# EAGLE design Nano+Sensores (EAGLE 8.5.1)
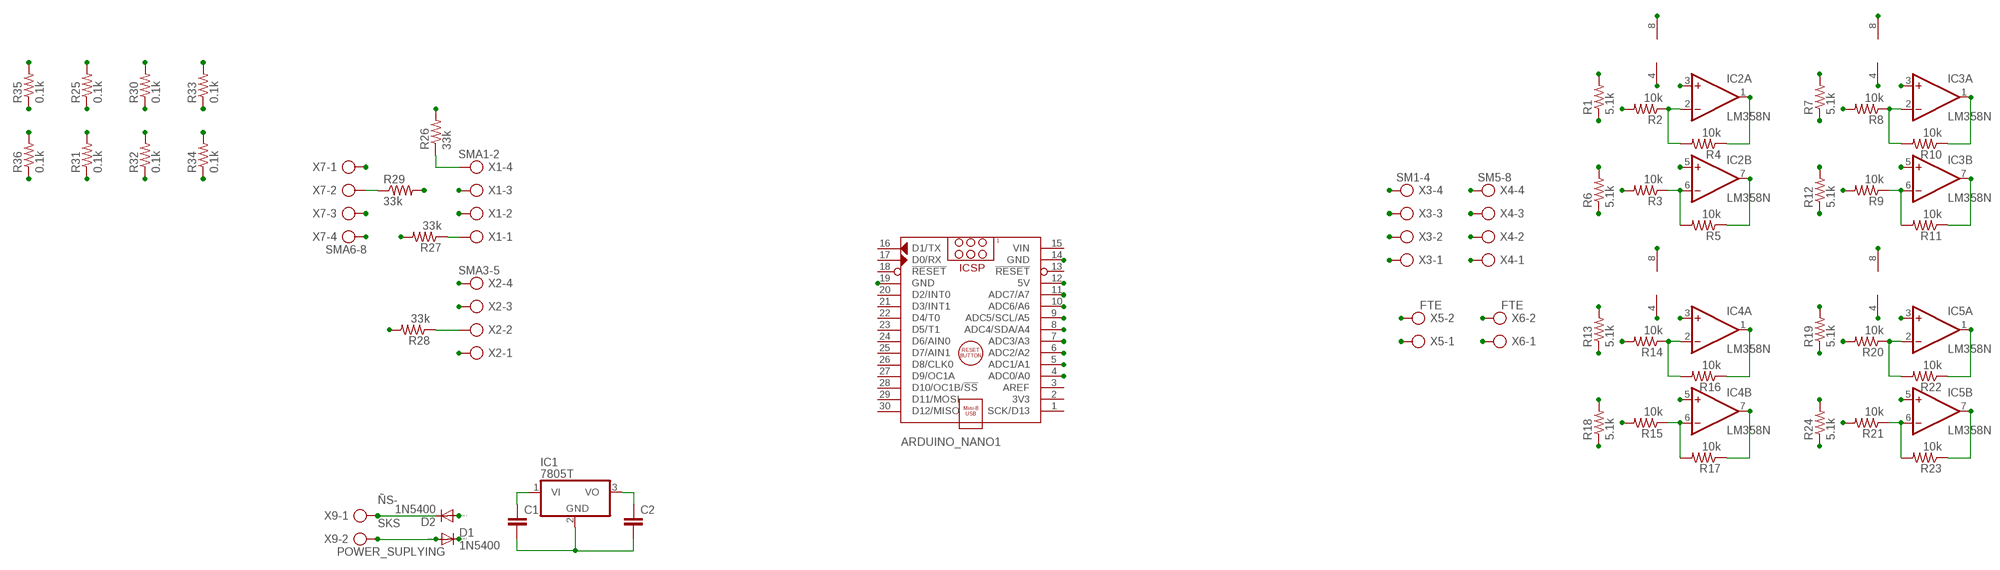
[diagram p0: schematic, sheet 1]

## Parts
ARDUINO_NANO1  ARDUINO_NANO  [ARDUINO_NANO]
C1  C-EU025-025X050  [C025-025X050]
C2  C-EU025-025X050  [C025-025X050]
D1  1N5400  [DO201-15]
D2  1N5400  [DO201-15]
IC1  7805T  [TO220H]
IC2  LM358N  [DIL08]
IC3  LM358N  [DIL08]
IC4  LM358N  [DIL08]
IC5  LM358N  [DIL08]
R1  5.1k  R-US_0204/5  [0204/5]
R2  10k  R-US_0204/5  [0204/5]
R3  10k  R-US_0204/5  [0204/5]
R4  10k  R-US_0204/5  [0204/5]
R5  10k  R-US_0204/5  [0204/5]
R6  5.1k  R-US_0204/5  [0204/5]
R7  5.1k  R-US_0204/5  [0204/5]
R8  10k  R-US_0204/5  [0204/5]
R9  10k  R-US_0204/5  [0204/5]
R10  10k  R-US_0204/5  [0204/5]
R11  10k  R-US_0204/5  [0204/5]
R12  5.1k  R-US_0204/5  [0204/5]
R13  5.1k  R-US_0204/5  [0204/5]
R14  10k  R-US_0204/5  [0204/5]
R15  10k  R-US_0204/5  [0204/5]
R16  10k  R-US_0204/5  [0204/5]
R17  10k  R-US_0204/5  [0204/5]
R18  5.1k  R-US_0204/5  [0204/5]
R19  5.1k  R-US_0204/5  [0204/5]
R20  10k  R-US_0204/5  [0204/5]
R21  10k  R-US_0204/5  [0204/5]
R22  10k  R-US_0204/5  [0204/5]
R23  10k  R-US_0204/5  [0204/5]
R24  5.1k  R-US_0204/5  [0204/5]
R25  0.1k  R-US_0204/5  [0204/5]
R26  33k  R-US_0204/5  [0204/5]
R27  33k  R-US_0204/5  [0204/5]
R28  33k  R-US_0204/5  [0204/5]
R29  33k  R-US_0204/5  [0204/5]
R30  0.1k  R-US_0204/5  [0204/5]
R31  0.1k  R-US_0204/5  [0204/5]
R32  0.1k  R-US_0204/5  [0204/5]
R33  0.1k  R-US_0204/5  [0204/5]
R34  0.1k  R-US_0204/5  [0204/5]
R35  0.1k  R-US_0204/5  [0204/5]
R36  0.1k  R-US_0204/5  [0204/5]
X1  SMA1-2  AK300/4  [AK300/4]
X2  SMA3-5  AK300/4  [AK300/4]
X3  SM1-4  AK300/4  [AK300/4]
X4  SM5-8  AK300/4  [AK300/4]
X5  FTE  AK300/2  [AK300/2]
X6  FTE  AK300/2  [AK300/2]
X7  SMA6-8  AK300/4  [AK300/4]
X9  POWER_SUPLYING  AK300/2  [AK300/2]

## Nets
+5V: ARDUINO_NANO1.12(5V) C2.1 IC1.3(VO) IC2.8(P:V+) IC3.8(P:V+) IC4.8(P:V+) IC5.8(P:V+) R1.2 R6.2 R7.2 R12.2 R13.2 R18.2 R19.2 R24.2 R25.2 R30.2 R31.2 R32.2 R33.2 R34.2 R35.2 R36.2
+12V: C1.1 D1.C IC1.1(VI) X5.2 X6.2
A0: ARDUINO_NANO1.4(ADC0/A0) IC2.1(A:OUT) R4.1
A1: ARDUINO_NANO1.5(ADC1/A1) IC2.7(B:OUT) R5.1
A2: ARDUINO_NANO1.6(ADC2/A2) IC3.1(A:OUT) R10.1
A3: ARDUINO_NANO1.7(ADC3/A3) IC3.7(B:OUT) R11.1
A4: ARDUINO_NANO1.8(ADC4/SDA/A4) IC4.1(A:OUT) R16.1
A5: ARDUINO_NANO1.9(ADC5/SCL/A5) IC4.7(B:OUT) R17.1
A6: ARDUINO_NANO1.10(ADC6/A6) IC5.1(A:OUT) R22.1
A7: ARDUINO_NANO1.11(ADC7/A7) IC5.7(B:OUT) R23.1
GND: ARDUINO_NANO1.14(GND) ARDUINO_NANO1.19(GND) C1.2 C2.2 D2.A IC1.2(GND) IC2.3(A:+IN) IC2.4(P:V-) IC2.5(B:+IN) IC3.3(A:+IN) IC3.4(P:V-) IC3.5(B:+IN) IC4.3(A:+IN) IC4.4(P:V-) IC4.5(B:+IN) IC5.3(A:+IN) IC5.4(P:V-) IC5.5(B:+IN) R26.2 R27.2 R28.2 R29.2 X5.1 X6.1
N$1: IC2.2(A:-IN) R2.1 R4.2
N$2: R27.1 X1.1
N$3: R29.1 X7.2
N$4: IC2.6(B:-IN) R3.1 R5.2
N$5: IC3.2(A:-IN) R8.1 R10.2
N$6: R26.1 X1.4
N$7: R28.1 X2.2
N$8: IC3.6(B:-IN) R9.1 R11.2
N$9: IC4.2(A:-IN) R14.1 R16.2
N$12: IC4.6(B:-IN) R15.1 R17.2
N$13: IC5.2(A:-IN) R20.1 R22.2
N$16: IC5.6(B:-IN) R21.1 R23.2
SG_SM1: R1.1 R2.2 X3.4
SG_SM2: R3.2 R6.1 X3.3
SG_SM3: R7.1 R8.2 X3.2
SG_SM4: R9.2 R12.1 X3.1
SG_SM5: R13.1 R14.2 X4.4
SG_SM6: R15.2 R18.1 X4.3
SG_SM7: R19.1 R20.2 X4.2
SG_SM8: R21.2 R24.1 X4.1
SKS: D1.A X9.2
SMA1: R25.1 X1.3
SMA2: R30.1 X1.2
SMA3: R33.1 X2.4
SMA4: R31.1 X2.3
SMA5: R32.1 X2.1
SMA6: R34.1 X7.1
SMA7: R35.1 X7.3
SMA8: R36.1 X7.4
ÑS-: D2.C X9.1
Unconnected: ARDUINO_NANO1.1(SCK/D13) ARDUINO_NANO1.2(3V3) ARDUINO_NANO1.3(AREF) ARDUINO_NANO1.13(!RESET) ARDUINO_NANO1.16(D1/TX) ARDUINO_NANO1.17(D0/RX) ARDUINO_NANO1.18(!RESET) ARDUINO_NANO1.20(D2/INT0) ARDUINO_NANO1.21(D3/INT1) ARDUINO_NANO1.22(D4/T0) ARDUINO_NANO1.23(D5/T1) ARDUINO_NANO1.24(D6/AIN0) ARDUINO_NANO1.25(D7/AIN1) ARDUINO_NANO1.26(D8/CLK0) ARDUINO_NANO1.27(D9/OC1A) ARDUINO_NANO1.28(D10/OC1B/!SS) ARDUINO_NANO1.29(D11/MOSI) ARDUINO_NANO1.30(D12/MISO)

## Power pins joined to a net without a drawn wire
VIN: ARDUINO_NANO1.15(VIN)

## Library data of the parts
ARDUINO_NANO1 = ArduinoNanoV30:ARDUINO_NANO: Arduino Nano V3.0 Module Overview: The Arduino Nano is a small, complete, and breadboard-friendly board based on the ATmega328 (Arduino Nano 3.x) or ATmega168 (Arduino Nano 2.x). It has more or less the same functionality of the Arduino Duemilanove, but in a different package. It lacks only a DC power jack, and works with a Mini-B USB cable instead of a standard one. The Nano was designed and is being produced by Gravitech <http://www.gravitech.us/arna30wiatp.html>. General specifications: Item Value Microcontroller Atmel ATmega168 or ATmega328 Operating Voltage (logic level) 5 V Input Voltage (recommended) 7-12 V Input Voltage (limits) 6-20 V Digital I/O Pins 14 (of which 6 provide PWM output) Analog Input Pins 8 DC Current per I/O Pin 40 mA Flash Memory 16 KB (ATmega168) or 32 KB (ATmega328) of which 2 KB used by bootloader SRAM 1 KB (ATmega168) or 2 KB (ATmega328) EEPROM 512 bytes (ATmega168) or 1 KB (ATmega328) Clock Speed 16 MHz Dimensions (Inches) 0.73" x 1.70" Dimensions (mm) 18mm x 45mm Overall height About 9 mm (not including pins) Weigth 5 g Power: The Arduino Nano can be powered via the Mini-B USB connection, 6-20V unregulated external power supply (pin 30), or 5V regulated external power supply (pin 27). The power source is automatically selected to the highest voltage source. Memory: The ATmega168 has 16 KB of flash memory for storing code (of which 2 KB is used for the bootloader); the ATmega328 has 32 KB, (also with 2 KB used for the bootloader). The ATmega168 has 1 KB of SRAM and 512 bytes of EEPROM (which can be read and written with the EEPROM library); the ATmega328 has 2 KB of SRAM and 1 KB of EEPROM. Input and Output: Each of the 14 digital pins on the Nano can be used as an input or output, using pinMode(), digitalWrite(), and digitalRead() functions. They operate at 5 volts. Each pin can provide or receive a maximum of 40 mA and has an internal pull-up resistor (disconnected by default) of 20-50 kOhms. In addition, some pins have specialized functions. Visit Arduino - ArduinoBoardNano <https://www.arduino.cc/en/Main/ArduinoBoardNano>
C1 C2 = rcl:C-EU: CAPACITOR, European symbol; SPICEPREFIX: C
D1 D2 = diode:1N5400: DIODE standard rectifier, 3 A, 50 V (Motorola)
IC1 = linear:78*: Positive VOLTAGE REGULATOR Source: http://cache.national.com/ds/LM/LM78L05.pdf http://www.fairchildsemi.com/ds/LM/LM7805.pdf
IC2-IC5 = linear:LM358: OP AMP also LM158; LM258; LM2904 Source: http://cache.national.com/ds/LM/LM158.pdf
R1-R36 = rcl:R-US_: RESISTOR, American symbol; SPICEPREFIX: R
X1-X4 X7 = con-ptr500:AK300/4: CONNECTOR; OC_FARNELL: unknown; OC_NEWARK: unknown
X5 X6 X9 = con-ptr500:AK300/2: CONNECTOR; OC_FARNELL: unknown; OC_NEWARK: unknown

## Board
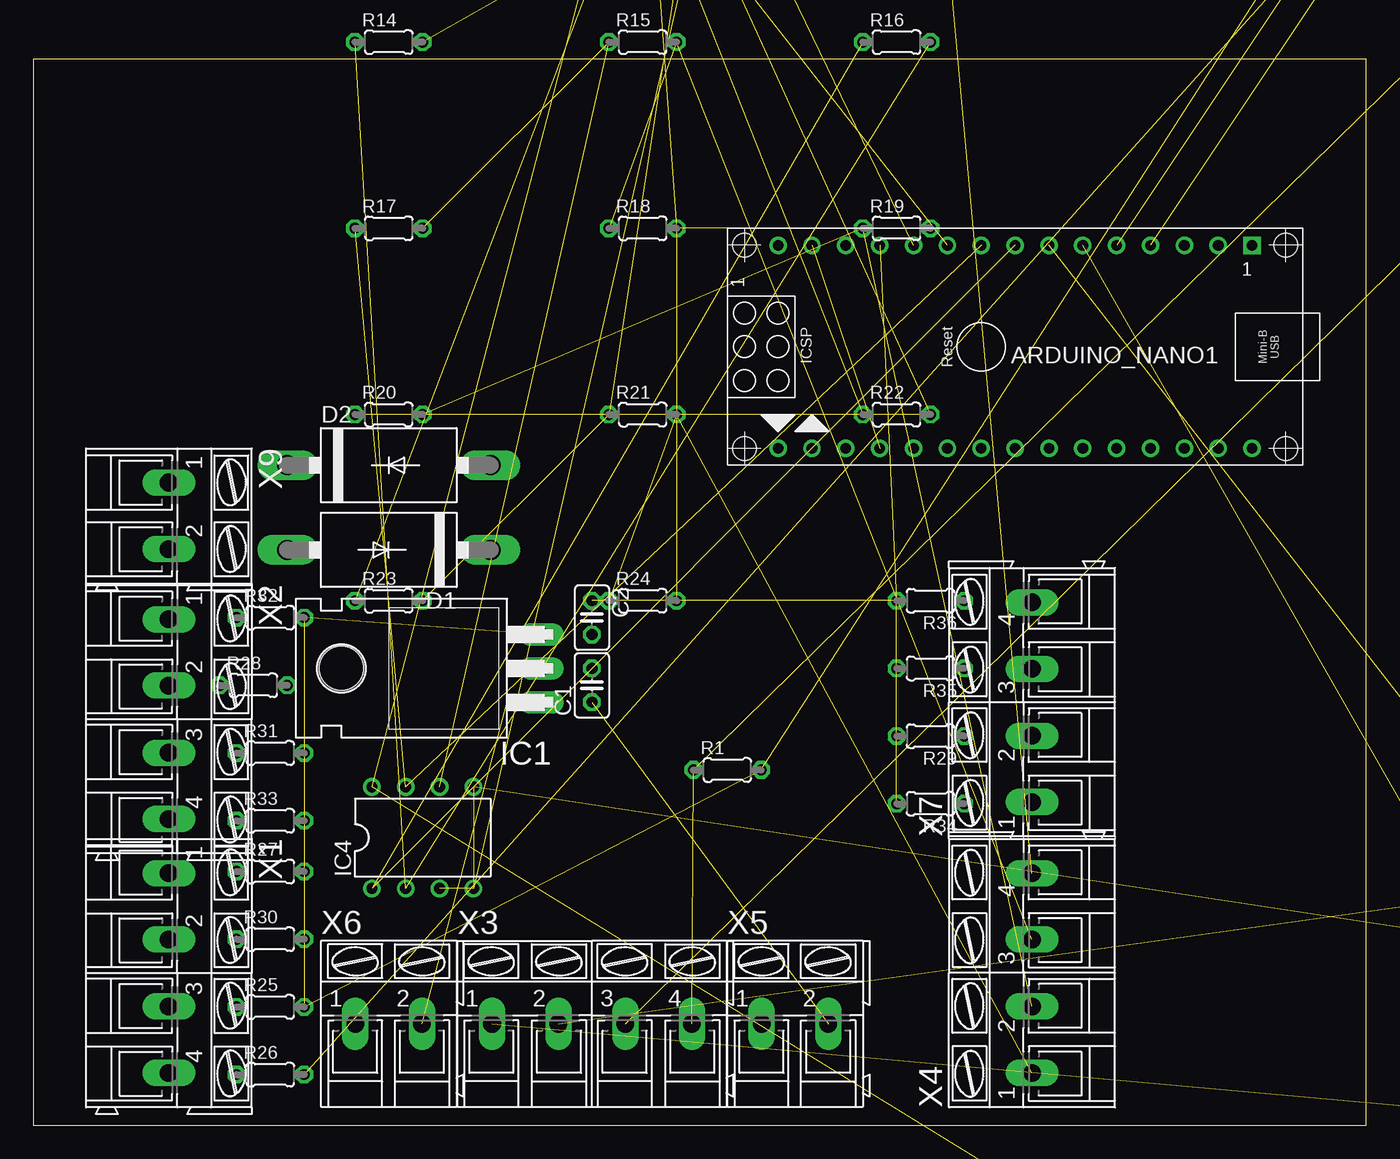
[diagram p1: board, top side]
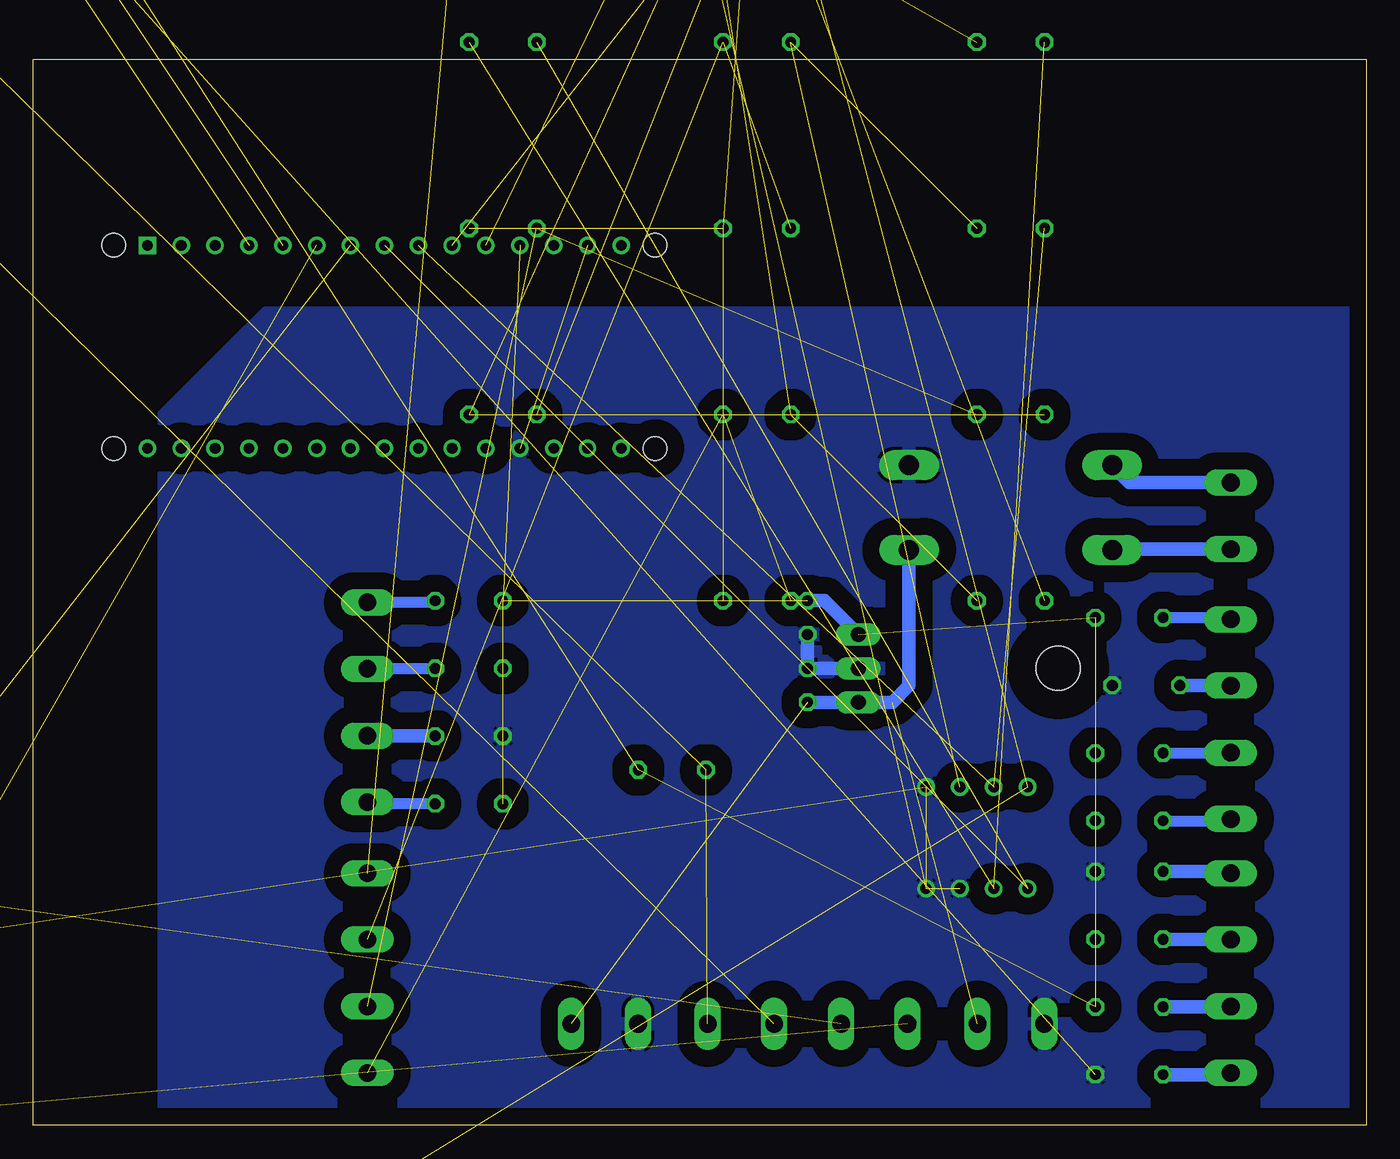
[diagram p2: board, bottom side, seen from below]

Size 100 x 80 mm. Coordinates in mm from the lower left corner, seen from the top.
Outline: 0,0 100,0 100,80 0,80 0,0
Copper layers (1*16): Top 0.035mm / dielectric 1.5mm / Bottom 0.035mm
Design rules "default": minimum track width 6mil, minimum drill 0.35mm, track to track 6mil, track to pad 6mil, pad to pad 6mil, via to via 6mil, smd to smd 6mil, copper to edge 40mil, drill to drill 6mil, minimum pad ring 10mil, minimum via ring 8mil, stop-mask expansion 4mil, vias tented up to drill 0mil, thermal gap 10mil

### Footprints (pad centres in the part's own frame; a part is rotated, then mirrored left to right if it is on the bottom)
ARDUINO_NANO = drill 0.8 square: 1 -20.32,-7.62 | drill 0.8: 2 -17.78,-7.62; 3 -15.24,-7.62; 4 -12.7,-7.62; 5 -10.16,-7.62; 6 -7.62,-7.62; 7 -5.08,-7.62; 8 -2.54,-7.62; 9 0,-7.62; 10 2.54,-7.62; 11 5.08,-7.62; 12 7.62,-7.62; 13 10.16,-7.62; 14 12.7,-7.62; 15 15.24,-7.62; 16 15.24,7.62; 17 12.7,7.62; 18 10.16,7.62; 19 7.62,7.62; 20 5.08,7.62; 21 2.54,7.62; 22 0,7.62; 23 -2.54,7.62; 24 -5.08,7.62; 25 -7.62,7.62; 26 -10.16,7.62; 27 -12.7,7.62; 28 -15.24,7.62; 29 -17.78,7.62; 30 -20.32,7.62 | hole 1.778: -22.86,-7.62; -22.86,7.62; 17.78,7.62; 17.78,-7.62
C025-025X050 = drill 0.813 octagon: 1 -1.27,0; 2 1.27,0
DO201-15 = drill 1.499 long: A 7.62,0; C -7.62,0
TO220H = drill 1.118 long: 1 -2.54,-10.16; 2 0,-10.16; 3 2.54,-10.16 | hole 3.302: 0,4.826
DIL08 = drill 0.813 pad 1.27: 1 -3.81,-3.81; 2 -1.27,-3.81; 3 1.27,-3.81; 4 3.81,-3.81; 5 3.81,3.81; 6 1.27,3.81; 7 -1.27,3.81; 8 -3.81,3.81
0204/5 = drill 0.813 octagon: 1 -2.54,0; 2 2.54,0
AK300/4 = drill 1.321 long: 1 -7.493,0; 2 -2.515,0; 3 2.515,0; 4 7.493,0
AK300/2 = drill 1.321 long: 1 -2.515,0; 2 2.489,0

### Placement (x,y rotation side)
ARDUINO_NANO1  71.12,58.42 180 top
C1  41.91,33.02 90 top
C2  41.91,38.1 270 top
D1  26.67,43.18 180 top
D2  26.67,49.53 0 top
IC1  27.94,34.29 90 top
IC2  113.03,107.95 0 top  (outside the outline)
IC3  113.03,16.51 0 top  (outside the outline)
IC4  29.21,21.59 0 top
IC5  49.53,99.06 0 top  (outside the outline)
R1  52.07,26.67 0 top
R2  111.76,90.17 0 top  (outside the outline)
R3  111.76,76.2 0 top  (outside the outline)
R4  111.76,62.23 0 top  (outside the outline)
R5  111.76,48.26 0 top  (outside the outline)
R6  111.76,34.29 0 top  (outside the outline)
R7  133.35,20.32 0 top  (outside the outline)
R8  111.76,-1.27 0 top  (outside the outline)
R9  130.81,-1.27 0 top  (outside the outline)
R10  111.76,-15.24 0 top  (outside the outline)
R11  130.81,-15.24 0 top  (outside the outline)
R12  111.76,-29.21 0 top  (outside the outline)
R13  69.85,102.87 0 top  (outside the outline)
R14  26.67,81.28 0 top
R15  45.72,81.28 0 top
R16  64.77,81.28 0 top
R17  26.67,67.31 0 top
R18  45.72,67.31 0 top
R19  64.77,67.31 0 top
R20  26.67,53.34 0 top
R21  45.72,53.34 0 top
R22  64.77,53.34 0 top
R23  26.67,39.37 0 top
R24  45.72,39.37 0 top
R25  17.78,8.89 0 top
R26  17.78,3.81 0 top
R27  17.78,19.05 0 top
R28  16.51,33.02 0 top
R29  67.31,29.21 180 top
R30  17.78,13.97 0 top
R31  17.78,27.94 0 top
R32  17.78,38.1 0 top
R33  17.78,22.86 0 top
R34  67.31,24.13 180 top
R35  67.31,34.29 180 top
R36  67.31,39.37 180 top
X1  10.16,11.43 270 top
X2  10.16,30.48 270 top
X3  41.91,7.62 0 top
X4  74.93,11.43 90 top
X5  57.15,7.62 0 top
X6  26.67,7.62 0 top
X7  74.93,31.75 90 top
X9  10.16,45.72 270 top

### Tracks (layer width: path | path; a pad name or v marks a point on that pad's centre or on a via)
+5V  (21 unrouted)
  Bottom 1.016: IC1.3 40.64,39.37 C2.1
+12V  (2 unrouted)
  Bottom 1.016: D1.C 34.29,33.02 35.56,31.75 IC1.1 C1.1
A0  (2 unrouted)
A1  (2 unrouted)
A2  (2 unrouted)
A3  (2 unrouted)
A4  (2 unrouted)
A5  (2 unrouted)
A6  (2 unrouted)
A7  (2 unrouted)
GND  (13 unrouted)
  Bottom 1.016: IC1.2 C1.2 C2.2
  pour Bottom (isolate 1.27): 1.27,58.42 1.27,0 90.17,0 90.17,53.34 85.09,58.42 82.55,60.96 1.27,60.96
N$1  (2 unrouted)
N$2
  Bottom 1.016: R27.1 10.29,19.05 X1.1
N$3
  Bottom 1.016: X7.2 69.88,29.23 R29.1
N$4  (2 unrouted)
N$5  (2 unrouted)
N$6
  Bottom 1.016: R26.1 10.29,3.81 X1.4
N$7
  Bottom 1.016: R28.1 10.19,33.02 X2.2
N$8  (2 unrouted)
N$9  (2 unrouted)
N$12  (2 unrouted)
N$13  (2 unrouted)
N$16  (2 unrouted)
SG_SM1  (2 unrouted)
SG_SM2  (2 unrouted)
SG_SM3  (2 unrouted)
SG_SM4  (2 unrouted)
SG_SM5  (2 unrouted)
SG_SM6  (2 unrouted)
SG_SM7  (2 unrouted)
SG_SM8  (2 unrouted)
SKS
  Bottom 1.016: X9.2 19,43.23 D1.A
SMA1
  Bottom 0.813: 10.19,8.89 X1.3
  Bottom 1.016: R25.1 10.19,8.89
SMA2
  Bottom 0.813: 10.19,13.97 X1.2
  Bottom 1.016: R30.1 10.19,13.97
SMA3
  Bottom 0.813: R33.1 10.29,22.86 X2.4
SMA4
  Bottom 0.813: R31.1 10.19,27.94 X2.3
SMA5
  Bottom 0.813: R32.1 10.29,38.1 X2.1
SMA6
  Bottom 0.813: R34.1 74.8,24.13 X7.1
SMA7
  Bottom 0.813: R35.1 69.88,34.27 X7.3
SMA8
  Bottom 0.813: R36.1 69.98,39.24 X7.4
ÑS-
  Bottom 1.016: X9.1 17.75,48.23 D2.C